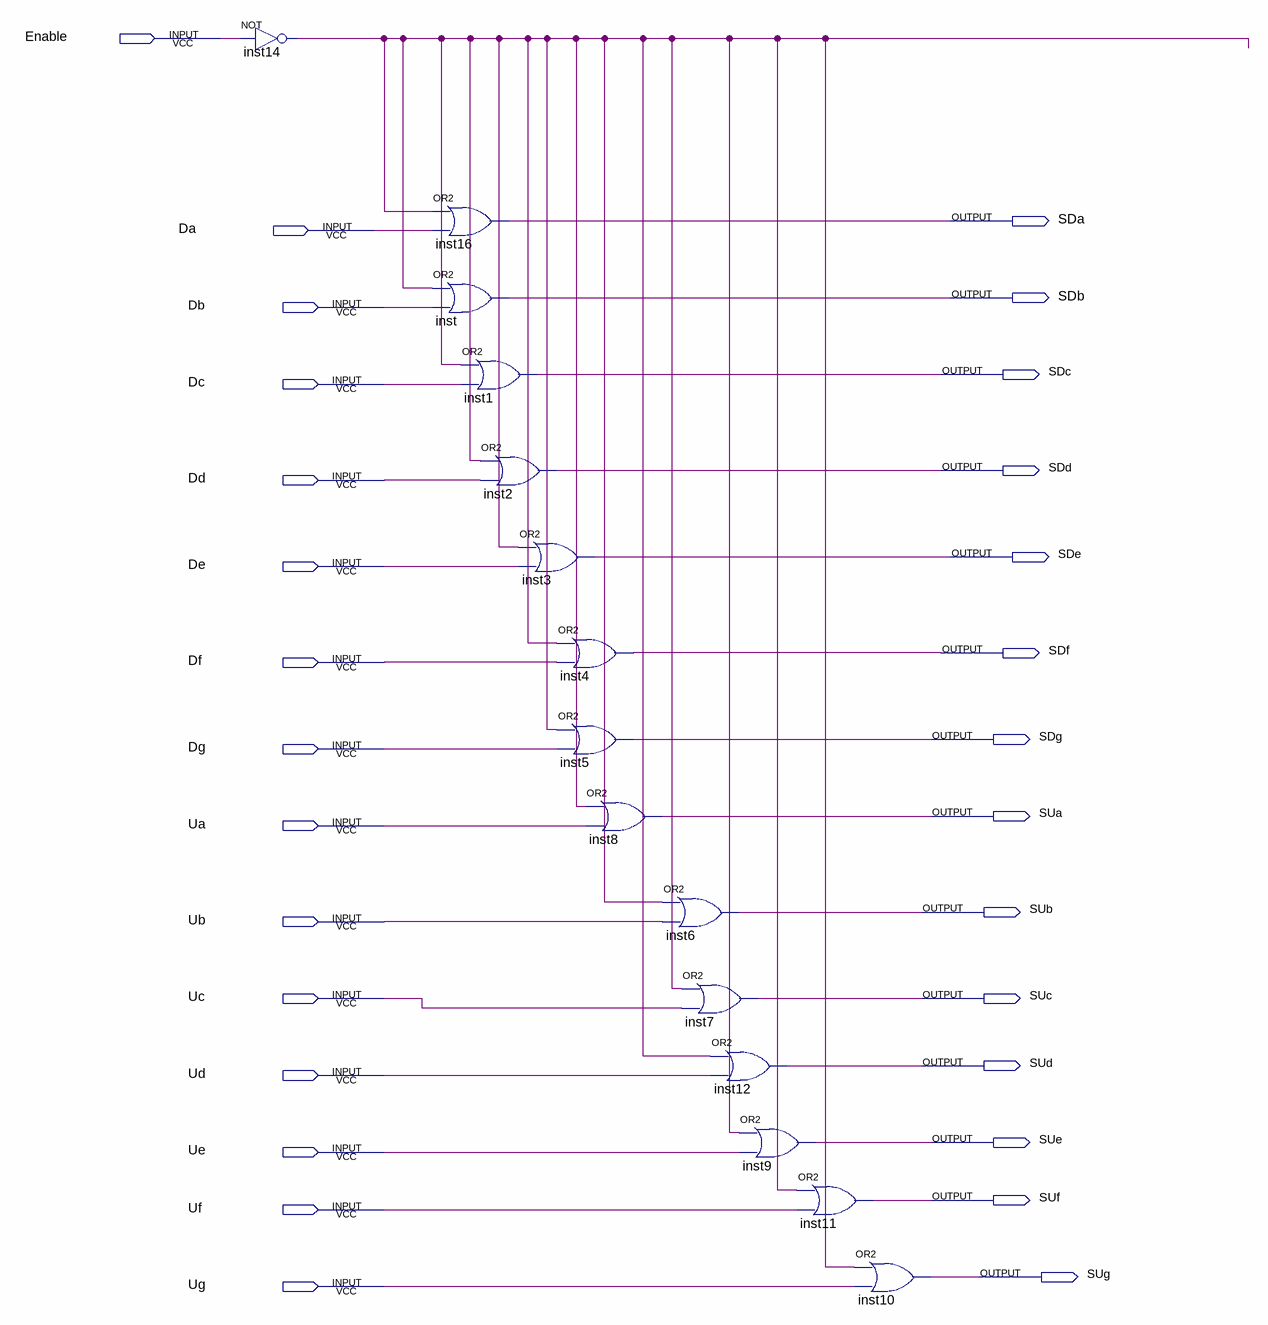
[diagram p0: schematic sheet]
// Quartus schematic logica_Inversora.bdf as structural Verilog: 15 symbols, 29 pins
module logica_Inversora (
  input  Enable,
  input  Da,
  input  Db,
  input  Dc,
  input  Dd,
  input  De,
  input  Df,
  input  Dg,
  input  Ua,
  input  Ub,
  input  Uc,
  input  Ud,
  input  Ue,
  input  Uf,
  input  Ug,
  output SDa,
  output SDb,
  output SDc,
  output SDd,
  output SDe,
  output SDf,
  output SDg,
  output SUa,
  output SUb,
  output SUc,
  output SUd,
  output SUe,
  output SUf,
  output SUg
);

  wire inst14_out;

  not inst14 (inst14_out, Enable);
  or inst16 (SDa, inst14_out, Da);
  or inst (SDb, inst14_out, Db);
  or inst1 (SDc, inst14_out, Dc);
  or inst2 (SDd, inst14_out, Dd);
  or inst3 (SDe, inst14_out, De);
  or inst4 (SDf, inst14_out, Df);
  or inst5 (SDg, inst14_out, Dg);
  or inst8 (SUa, inst14_out, Ua);
  or inst6 (SUb, inst14_out, Ub);
  or inst7 (SUc, inst14_out, Uc);
  or inst12 (SUd, inst14_out, Ud);
  or inst9 (SUe, inst14_out, Ue);
  or inst11 (SUf, inst14_out, Uf);
  or inst10 (SUg, inst14_out, Ug);
endmodule
